# Altium schematic sheet Page07 CPU PHY.SchDoc
size 513 x 386 mm
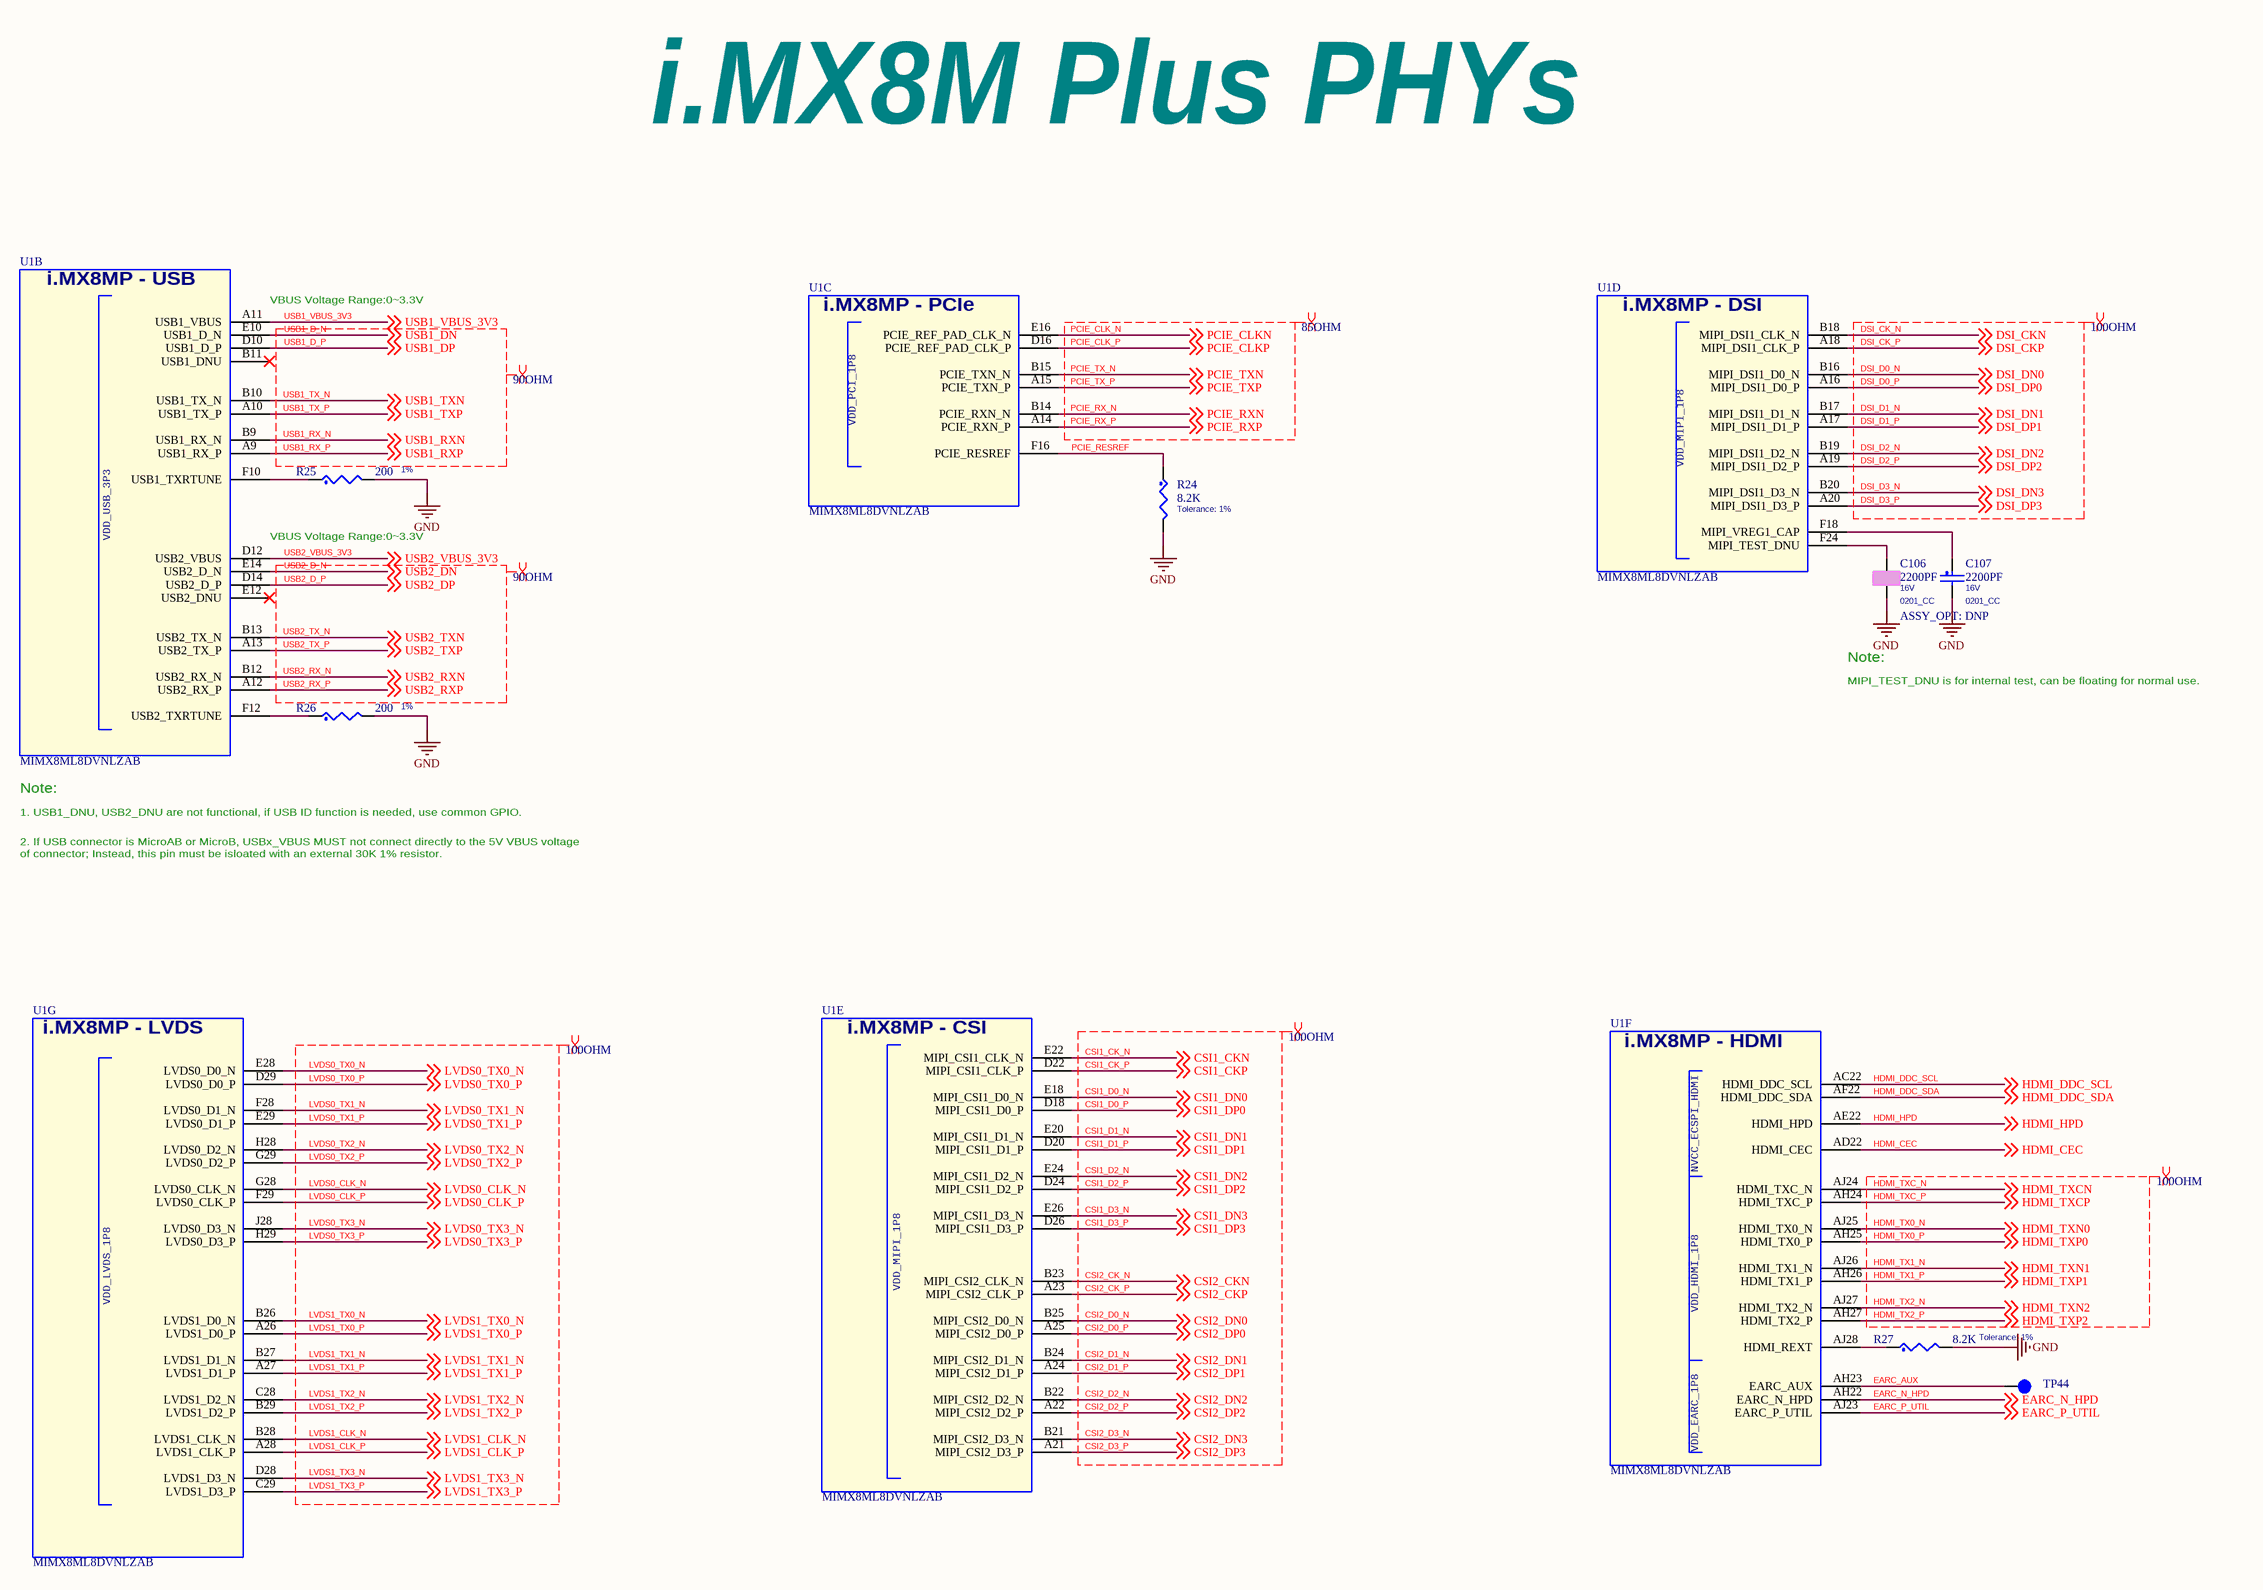
[diagram p0: Page07 CPU PHY.SchDoc]

## Parts
C106  2200PF  ASSY_OPT: DNP  VOLTAGE: 16V  [0201_CC]
C107  2200PF  VOLTAGE: 16V  [0201_CC]
R24  8.2K  Tolerance: 1%  [0201_CC]
R25  200  Tolerance: 1%  [0201_CC]
R26  200  Tolerance: 1%  [0201_CC]
R27  8.2K  Tolerance: 1%  [0201_CC]
TP44  tpad_020  [tpad_020]  (value not drawn)
U1  MIMX8ML8DVNLZAB  [BGA_M865S_0P5_15X15-BMS]  (parts B,C,D,E,F,G of 15)

## Nets
GND: C106.2 C107.2 R24.2 R25.2 R26.2 R27.2
CSI1_CK_N: U1.E22(MIPI_CSI1_CLK_N) ; off-sheet CSI1_CKN  [also labelled CSI1_CKN]
CSI1_CK_P: U1.D22(MIPI_CSI1_CLK_P) ; off-sheet CSI1_CKP  [also labelled CSI1_CKP]
CSI1_D0_N: U1.E18(MIPI_CSI1_D0_N) ; off-sheet CSI1_DN0  [also labelled CSI1_DN0]
CSI1_D0_P: U1.D18(MIPI_CSI1_D0_P) ; off-sheet CSI1_DP0  [also labelled CSI1_DP0]
CSI1_D1_N: U1.E20(MIPI_CSI1_D1_N) ; off-sheet CSI1_DN1  [also labelled CSI1_DN1]
CSI1_D1_P: U1.D20(MIPI_CSI1_D1_P) ; off-sheet CSI1_DP1  [also labelled CSI1_DP1]
CSI1_D2_N: U1.E24(MIPI_CSI1_D2_N) ; off-sheet CSI1_DN2  [also labelled CSI1_DN2]
CSI1_D2_P: U1.D24(MIPI_CSI1_D2_P) ; off-sheet CSI1_DP2  [also labelled CSI1_DP2]
CSI1_D3_N: U1.E26(MIPI_CSI1_D3_N) ; off-sheet CSI1_DN3  [also labelled CSI1_DN3]
CSI1_D3_P: U1.D26(MIPI_CSI1_D3_P) ; off-sheet CSI1_DP3  [also labelled CSI1_DP3]
CSI2_CK_N: U1.B23(MIPI_CSI2_CLK_N) ; off-sheet CSI2_CKN  [also labelled CSI2_CKN]
CSI2_CK_P: U1.A23(MIPI_CSI2_CLK_P) ; off-sheet CSI2_CKP  [also labelled CSI2_CKP]
CSI2_D0_N: U1.B25(MIPI_CSI2_D0_N) ; off-sheet CSI2_DN0  [also labelled CSI2_DN0]
CSI2_D0_P: U1.A25(MIPI_CSI2_D0_P) ; off-sheet CSI2_DP0  [also labelled CSI2_DP0]
CSI2_D1_N: U1.B24(MIPI_CSI2_D1_N) ; off-sheet CSI2_DN1  [also labelled CSI2_DN1]
CSI2_D1_P: U1.A24(MIPI_CSI2_D1_P) ; off-sheet CSI2_DP1  [also labelled CSI2_DP1]
CSI2_D2_N: U1.B22(MIPI_CSI2_D2_N) ; off-sheet CSI2_DN2  [also labelled CSI2_DN2]
CSI2_D2_P: U1.A22(MIPI_CSI2_D2_P) ; off-sheet CSI2_DP2  [also labelled CSI2_DP2]
CSI2_D3_N: U1.B21(MIPI_CSI2_D3_N) ; off-sheet CSI2_DN3  [also labelled CSI2_DN3]
CSI2_D3_P: U1.A21(MIPI_CSI2_D3_P) ; off-sheet CSI2_DP3  [also labelled CSI2_DP3]
DSI_CK_N: U1.B18(MIPI_DSI1_CLK_N) ; off-sheet DSI_CKN  [also labelled DSI_CKN]
DSI_CK_P: U1.A18(MIPI_DSI1_CLK_P) ; off-sheet DSI_CKP  [also labelled DSI_CKP]
DSI_D0_N: U1.B16(MIPI_DSI1_D0_N) ; off-sheet DSI_DN0  [also labelled DSI_DN0]
DSI_D0_P: U1.A16(MIPI_DSI1_D0_P) ; off-sheet DSI_DP0  [also labelled DSI_DP0]
DSI_D1_N: U1.B17(MIPI_DSI1_D1_N) ; off-sheet DSI_DN1  [also labelled DSI_DN1]
DSI_D1_P: U1.A17(MIPI_DSI1_D1_P) ; off-sheet DSI_DP1  [also labelled DSI_DP1]
DSI_D2_N: U1.B19(MIPI_DSI1_D2_N) ; off-sheet DSI_DN2  [also labelled DSI_DN2]
DSI_D2_P: U1.A19(MIPI_DSI1_D2_P) ; off-sheet DSI_DP2  [also labelled DSI_DP2]
DSI_D3_N: U1.B20(MIPI_DSI1_D3_N) ; off-sheet DSI_DN3  [also labelled DSI_DN3]
DSI_D3_P: U1.A20(MIPI_DSI1_D3_P) ; off-sheet DSI_DP3  [also labelled DSI_DP3]
EARC_AUX: TP44.1(Pin1) U1.AH23(EARC_AUX)
EARC_N_HPD: U1.AH22(EARC_N_HPD) ; off-sheet EARC_N_HPD
EARC_P_UTIL: U1.AJ23(EARC_P_UTIL) ; off-sheet EARC_P_UTIL
HDMI_CEC: U1.AD22(HDMI_CEC) ; off-sheet HDMI_CEC
HDMI_DDC_SCL: U1.AC22(HDMI_DDC_SCL) ; off-sheet HDMI_DDC_SCL
HDMI_DDC_SDA: U1.AF22(HDMI_DDC_SDA) ; off-sheet HDMI_DDC_SDA
HDMI_HPD: U1.AE22(HDMI_HPD) ; off-sheet HDMI_HPD
HDMI_TX0_N: U1.AJ25(HDMI_TX0_N) ; off-sheet HDMI_TXN0  [also labelled HDMI_TXN0]
HDMI_TX0_P: U1.AH25(HDMI_TX0_P) ; off-sheet HDMI_TXP0  [also labelled HDMI_TXP0]
HDMI_TX1_N: U1.AJ26(HDMI_TX1_N) ; off-sheet HDMI_TXN1  [also labelled HDMI_TXN1]
HDMI_TX1_P: U1.AH26(HDMI_TX1_P) ; off-sheet HDMI_TXP1  [also labelled HDMI_TXP1]
HDMI_TX2_N: U1.AJ27(HDMI_TX2_N) ; off-sheet HDMI_TXN2  [also labelled HDMI_TXN2]
HDMI_TX2_P: U1.AH27(HDMI_TX2_P) ; off-sheet HDMI_TXP2  [also labelled HDMI_TXP2]
HDMI_TXC_N: U1.AJ24(HDMI_TXC_N) ; off-sheet HDMI_TXCN  [also labelled HDMI_TXCN]
HDMI_TXC_P: U1.AH24(HDMI_TXC_P) ; off-sheet HDMI_TXCP  [also labelled HDMI_TXCP]
LVDS0_CLK_N: U1.G28(LVDS0_CLK_N) ; off-sheet LVDS0_CLK_N
LVDS0_CLK_P: U1.F29(LVDS0_CLK_P) ; off-sheet LVDS0_CLK_P
LVDS0_TX0_N: U1.E28(LVDS0_D0_N) ; off-sheet LVDS0_TX0_N
LVDS0_TX0_P: U1.D29(LVDS0_D0_P) ; off-sheet LVDS0_TX0_P
LVDS0_TX1_N: U1.F28(LVDS0_D1_N) ; off-sheet LVDS0_TX1_N
LVDS0_TX1_P: U1.E29(LVDS0_D1_P) ; off-sheet LVDS0_TX1_P
LVDS0_TX2_N: U1.H28(LVDS0_D2_N) ; off-sheet LVDS0_TX2_N
LVDS0_TX2_P: U1.G29(LVDS0_D2_P) ; off-sheet LVDS0_TX2_P
LVDS0_TX3_N: U1.J28(LVDS0_D3_N) ; off-sheet LVDS0_TX3_N
LVDS0_TX3_P: U1.H29(LVDS0_D3_P) ; off-sheet LVDS0_TX3_P
LVDS1_CLK_N: U1.B28(LVDS1_CLK_N) ; off-sheet LVDS1_CLK_N
LVDS1_CLK_P: U1.A28(LVDS1_CLK_P) ; off-sheet LVDS1_CLK_P
LVDS1_TX0_N: U1.B26(LVDS1_D0_N) ; off-sheet LVDS1_TX0_N
LVDS1_TX0_P: U1.A26(LVDS1_D0_P) ; off-sheet LVDS1_TX0_P
LVDS1_TX1_N: U1.B27(LVDS1_D1_N) ; off-sheet LVDS1_TX1_N
LVDS1_TX1_P: U1.A27(LVDS1_D1_P) ; off-sheet LVDS1_TX1_P
LVDS1_TX2_N: U1.C28(LVDS1_D2_N) ; off-sheet LVDS1_TX2_N
LVDS1_TX2_P: U1.B29(LVDS1_D2_P) ; off-sheet LVDS1_TX2_P
LVDS1_TX3_N: U1.D28(LVDS1_D3_N) ; off-sheet LVDS1_TX3_N
LVDS1_TX3_P: U1.C29(LVDS1_D3_P) ; off-sheet LVDS1_TX3_P
PCIE_CLK_N: U1.E16(PCIE_REF_PAD_CLK_N) ; off-sheet PCIE_CLKN  [also labelled PCIE_CLKN]
PCIE_CLK_P: U1.D16(PCIE_REF_PAD_CLK_P) ; off-sheet PCIE_CLKP  [also labelled PCIE_CLKP]
PCIE_RESREF: R24.1 U1.F16(PCIE_RESREF)
PCIE_RX_N: U1.B14(PCIE_RXN_N) ; off-sheet PCIE_RXN  [also labelled PCIE_RXN]
PCIE_RX_P: U1.A14(PCIE_RXN_P) ; off-sheet PCIE_RXP  [also labelled PCIE_RXP]
PCIE_TX_N: U1.B15(PCIE_TXN_N) ; off-sheet PCIE_TXN  [also labelled PCIE_TXN]
PCIE_TX_P: U1.A15(PCIE_TXN_P) ; off-sheet PCIE_TXP  [also labelled PCIE_TXP]
USB1_D_N: U1.E10(USB1_D_N) ; off-sheet USB1_DN  [also labelled USB1_DN]
USB1_D_P: U1.D10(USB1_D_P) ; off-sheet USB1_DP  [also labelled USB1_DP]
USB1_RX_N: U1.B9(USB1_RX_N) ; off-sheet USB1_RXN  [also labelled USB1_RXN]
USB1_RX_P: U1.A9(USB1_RX_P) ; off-sheet USB1_RXP  [also labelled USB1_RXP]
USB1_TX_N: U1.B10(USB1_TX_N) ; off-sheet USB1_TXN  [also labelled USB1_TXN]
USB1_TX_P: U1.A10(USB1_TX_P) ; off-sheet USB1_TXP  [also labelled USB1_TXP]
USB1_VBUS_3V3: U1.A11(USB1_VBUS) ; off-sheet USB1_VBUS_3V3
USB2_D_N: U1.E14(USB2_D_N) ; off-sheet USB2_DN  [also labelled USB2_DN]
USB2_D_P: U1.D14(USB2_D_P) ; off-sheet USB2_DP  [also labelled USB2_DP]
USB2_RX_N: U1.B12(USB2_RX_N) ; off-sheet USB2_RXN  [also labelled USB2_RXN]
USB2_RX_P: U1.A12(USB2_RX_P) ; off-sheet USB2_RXP  [also labelled USB2_RXP]
USB2_TX_N: U1.B13(USB2_TX_N) ; off-sheet USB2_TXN  [also labelled USB2_TXN]
USB2_TX_P: U1.A13(USB2_TX_P) ; off-sheet USB2_TXP  [also labelled USB2_TXP]
USB2_VBUS_3V3: U1.D12(USB2_VBUS) ; off-sheet USB2_VBUS_3V3
NetC106_1: C106.1 U1.F24(MIPI_TEST_DNU)
NetC107_1: C107.1 U1.F18(MIPI_VREG1_CAP)
NetR25_1: R25.1 U1.F10(USB1_TXRTUNE)
NetR26_1: R26.1 U1.F12(USB2_TXRTUNE)
NetR27_1: R27.1 U1.AJ28(HDMI_REXT)

Not connected (* = marked no-connect by the designer): U1 B11(USB1_DNU)* E12(USB2_DNU)*

## Layout directives
differential pair; net class USB; differential pair class 90OHM: USB1_D_N, USB1_D_P, USB1_DN, USB1_DP, USB1_RX_N, USB1_RX_P, USB1_RXN, USB1_RXP, USB1_TX_N, USB1_TX_P, USB1_TXN, USB1_TXP, USB2_D_N, USB2_D_P, USB2_DN, USB2_DP, USB2_RX_N, USB2_RX_P, USB2_RXN, USB2_RXP, USB2_TX_N, USB2_TX_P, USB2_TXN, USB2_TXP
differential pair; net class PCIE; differential pair class 85OHM: PCIE_CLK_N, PCIE_CLK_P, PCIE_CLKN, PCIE_CLKP, PCIE_RX_N, PCIE_RX_P, PCIE_RXN, PCIE_RXP, PCIE_TX_N, PCIE_TX_P, PCIE_TXN, PCIE_TXP
differential pair; net class DSI; differential pair class 100OHM: DSI_CK_N, DSI_CK_P, DSI_CKN, DSI_CKP, DSI_D0_N, DSI_D0_P, DSI_D1_N, DSI_D1_P, DSI_D2_N, DSI_D2_P, DSI_D3_N, DSI_D3_P, DSI_DN0, DSI_DN1, DSI_DN2, DSI_DN3, DSI_DP0, DSI_DP1, DSI_DP2, DSI_DP3
differential pair; net class HDMI; differential pair class 100OHM: HDMI_TX0_N, HDMI_TX0_P, HDMI_TX1_N, HDMI_TX1_P, HDMI_TX2_N, HDMI_TX2_P, HDMI_TXC_N, HDMI_TXC_P, HDMI_TXCN, HDMI_TXCP, HDMI_TXN0, HDMI_TXN1, HDMI_TXN2, HDMI_TXP0, HDMI_TXP1, HDMI_TXP2
differential pair; net class CSI; differential pair class 100OHM: CSI1_CK_N, CSI1_CK_P, CSI1_CKN, CSI1_CKP, CSI1_D0_N, CSI1_D0_P, CSI1_D1_N, CSI1_D1_P, CSI1_D2_N, CSI1_D2_P, CSI1_D3_N, CSI1_D3_P, CSI1_DN0, CSI1_DN1, CSI1_DN2, CSI1_DN3, CSI1_DP0, CSI1_DP1, CSI1_DP2, CSI1_DP3, CSI2_CK_N, CSI2_CK_P, CSI2_CKN, CSI2_CKP, CSI2_D0_N, CSI2_D0_P, CSI2_D1_N, CSI2_D1_P, CSI2_D2_N, CSI2_D2_P, CSI2_D3_N, CSI2_D3_P, CSI2_DN0, CSI2_DN1, CSI2_DN2, CSI2_DN3, CSI2_DP0, CSI2_DP1, CSI2_DP2, CSI2_DP3
differential pair; net class LVDS; differential pair class 100OHM: LVDS0_CLK_N, LVDS0_CLK_P, LVDS0_TX0_N, LVDS0_TX0_P, LVDS0_TX1_N, LVDS0_TX1_P, LVDS0_TX2_N, LVDS0_TX2_P, LVDS0_TX3_N, LVDS0_TX3_P, LVDS1_CLK_N, LVDS1_CLK_P, LVDS1_TX0_N, LVDS1_TX0_P, LVDS1_TX1_N, LVDS1_TX1_P, LVDS1_TX2_N, LVDS1_TX2_P, LVDS1_TX3_N, LVDS1_TX3_P

## Notes on the sheet
- i.MX8M Plus PHYs
- (near U1) VBUS Voltage Range:0~3.3V
- VBUS Voltage Range:0~3.3V
- MIPI_TEST_DNU is for internal test, can be floating for normal use.
- Note:
- 1. USB1_DNU, USB2_DNU are not functional, if USB ID function is needed, use common GPIO.
- 2. If USB connector is MicroAB or MicroB, USBx_VBUS MUST not connect directly to the 5V VBUS voltage
  of connector; Instead, this pin must be isloated with an external 30K 1% resistor.
- (in symbol MIMX8MP_BGA548, part B) i.MX8MP - USB
- (in symbol MIMX8MP_BGA548, part C) i.MX8MP - PCIe
- (in symbol MIMX8MP_BGA548, part D) i.MX8MP - DSI
- (in symbol MIMX8MP_BGA548, part E) i.MX8MP - CSI
- (in symbol MIMX8MP_BGA548, part F) i.MX8MP - HDMI
- (in symbol MIMX8MP_BGA548, part G) i.MX8MP - LVDS

## Library data of the parts
C106 = CAP_NP: CAP CER 2200PF 16V 10% X7R 0201; CLASS: DISCRETE; FPLIST: CC0201,CC0201_HD,0201_CC; CAD_APPROVED: Yes; MFG_PN01: GRM033R71C222KA88D; MFG_NAME01: MURATA; Tolerance: 20%; AGILE_PN: 150-78660; PCB Footprint: 0201_CC; HEIGHT: 0.33 MM; ROHS: Yes
C107 = CAP_NP: CAP CER 2200PF 16V 10% X7R 0201; CLASS: DISCRETE; AGILE_PN: 150-78660; Tolerance: 20%; MFG_NAME01: MURATA; MFG_PN01: GRM033R71C222KA88D; CAD_APPROVED: Yes; FPLIST: CC0201,CC0201_HD,0201_CC; PCB Footprint: 0201_CC; ROHS: Yes; HEIGHT: 0.33 MM
R24 = RES: RES MF 8.2K 1/20W 1% 0201; CLASS: DISCRETE; AGILE_PN: 470-82483; FPLIST: RC0201,0201_CC; CAD_APPROVED: Yes; MFG_NAME01: YAGEO AMERICA; MFG_PN01: RC0201FR-078K2L; PCB Footprint: 0201_CC; Package Size: 0201 (0603 Metric); HEIGHT: 0.26MM; Package Type: SMD; ROHS: Yes
R25 = RES: RES MF 200 OHM 1/20W 1% 0201; CLASS: DISCRETE; FPLIST: RC0201,0201_CC; CAD_APPROVED: Yes; Temp_Range: -55¡ãC ~ 125¡ãC; MFG_PN01: RC0201FR-07200RL; MFG_NAME01: YAGEO AMERICA; AGILE_PN: 470-82323; VOLTAGE: 25V; PCB Footprint: 0201_CC; HEIGHT: 0.26MM; ROHS: Yes; Temp Range: -55¡ãC ~ 125¡ãC
R26 = RES: RES MF 200 OHM 1/20W 1% 0201; CLASS: DISCRETE; AGILE_PN: 470-82323; MFG_NAME01: YAGEO AMERICA; MFG_PN01: RC0201FR-07200RL; Temp_Range: -55¡ãC ~ 125¡ãC; CAD_APPROVED: Yes; FPLIST: RC0201,0201_CC; VOLTAGE: 25V; PCB Footprint: 0201_CC; ROHS: Yes; HEIGHT: 0.26MM; Temp Range: -55¡ãC ~ 125¡ãC
R27 = RES: RES MF 8.2K 1/20W 1% 0201; CLASS: DISCRETE; MFG_PN01: RC0201FR-078K2L; MFG_NAME01: YAGEO AMERICA; CAD_APPROVED: Yes; FPLIST: RC0201,0201_CC; AGILE_PN: 470-82483; PCB Footprint: 0201_CC; ROHS: Yes; Package Type: SMD; HEIGHT: 0.26MM; Package Size: 0201 (0603 Metric)
TP44 = TESTLOOP: TEST POINT PAD 0.5MM DIA SMT, NO PART TO ORDER; ASSY_OPT: DNP; CLASS: IO; AGILE_PN: 211-77484; CAD_APPROVED: Yes; PCB Footprint: tpad_020; ROHS: Yes; HEIGHT: 0.1MM
U1 = MIMX8MP_BGA548: IC CPU QUAD CORTEX A53+M4 1.8GHZ BGA548; SPLIT_INST: TRUE; PCB Footprint: bga548_0p5_15x15mm; CAD_APPROVED: Yes; MFG_NAME01: NXP SEMICONDUCTORS; AGILE_PN: 330-77126; CLASS: IC; HEIGHT: 2.1MM; MFG_PN01: MIMX8ML8DVNLZAB